# EAGLE schematic scoreboard_proto (EAGLE 9.0.1)
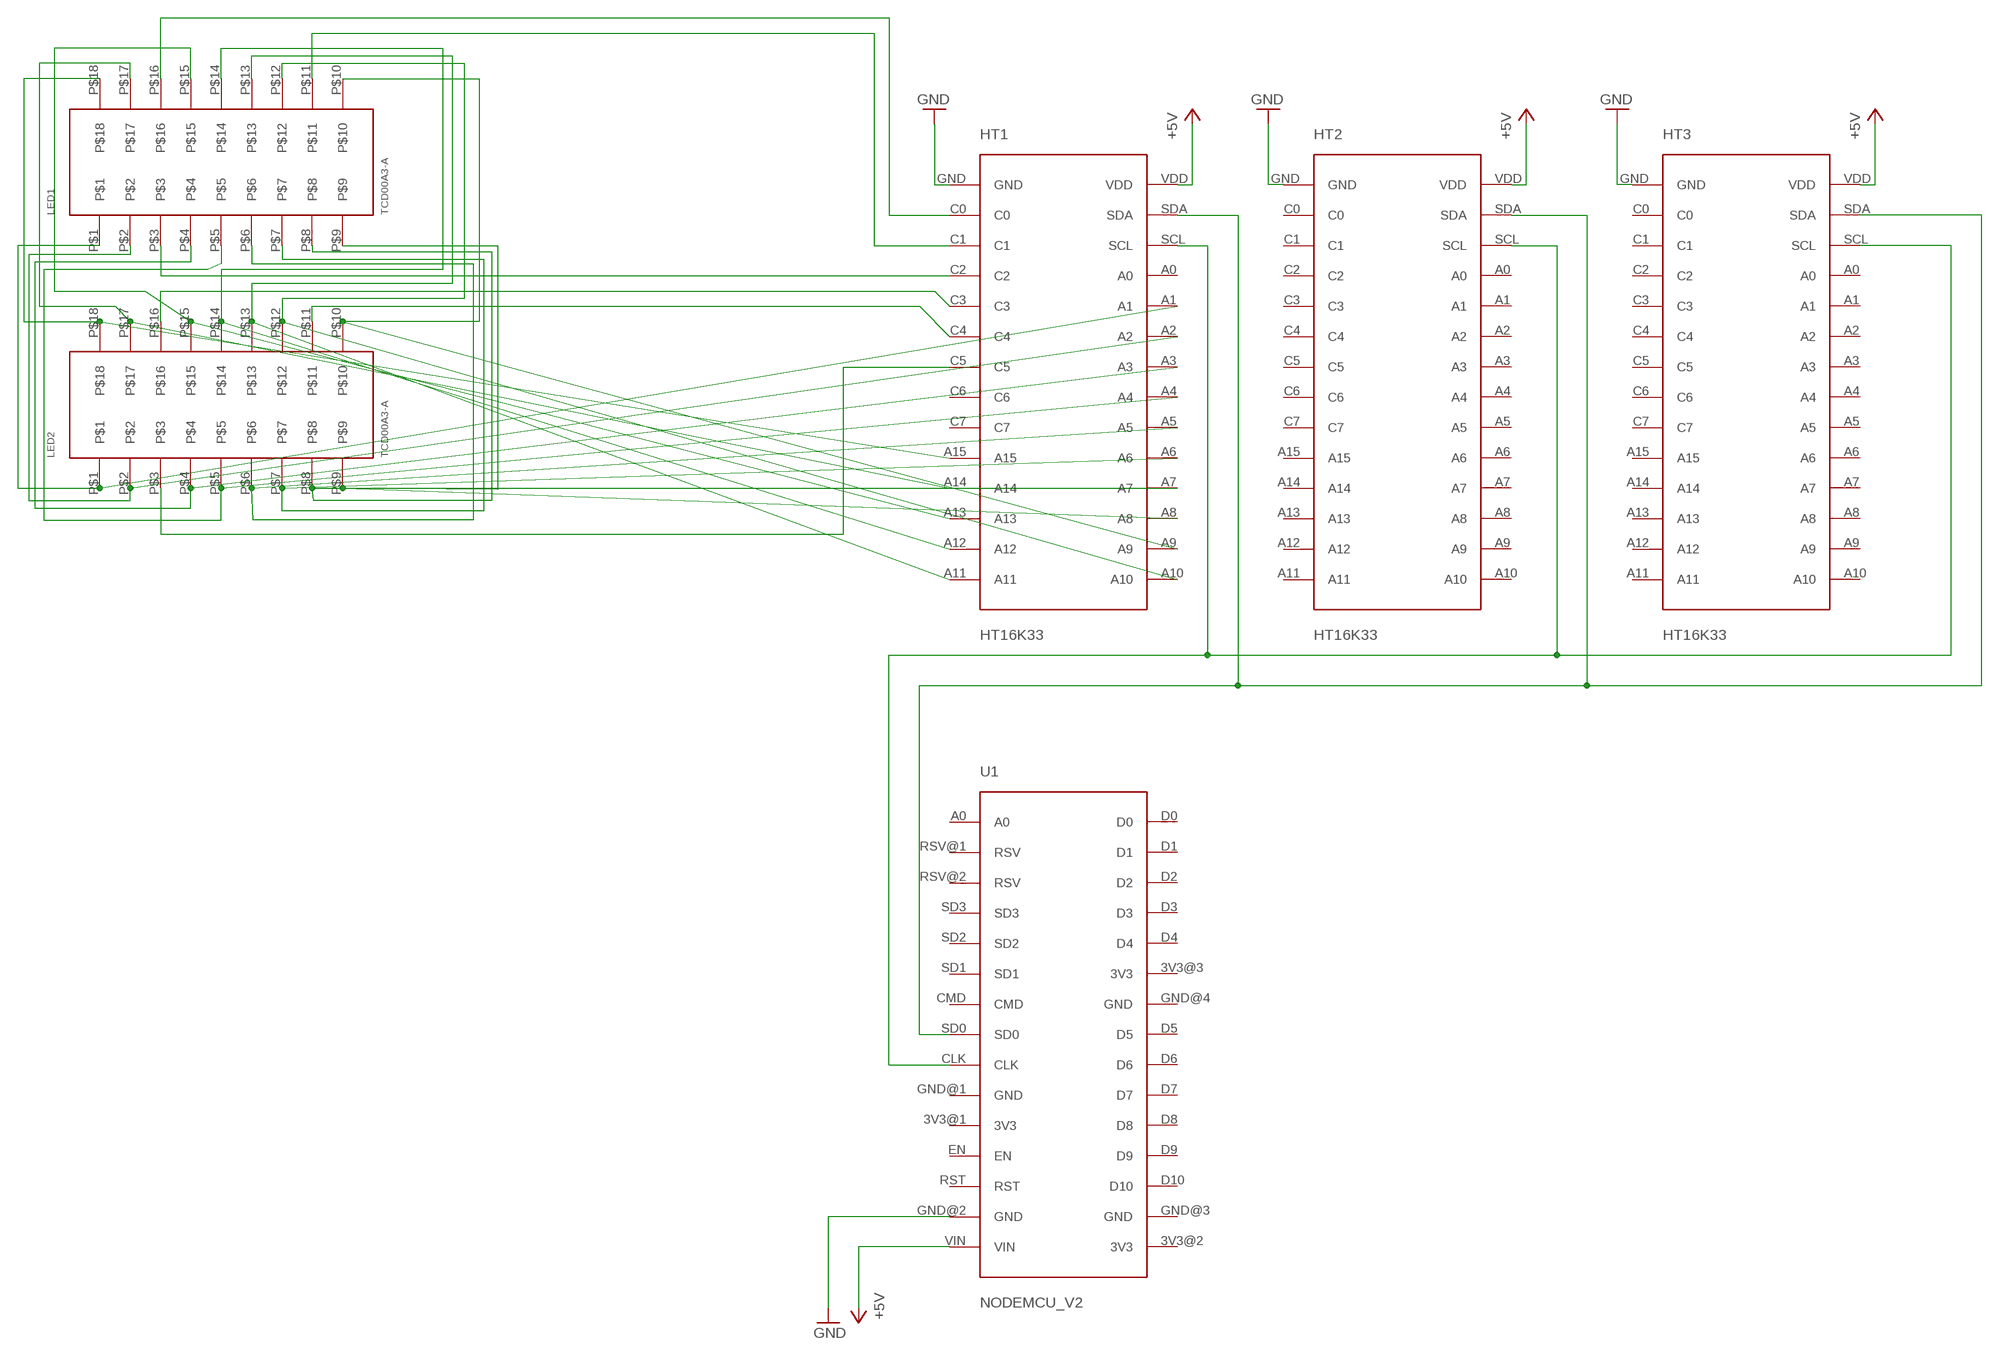
[diagram p0: schematic, sheet 1]

## Parts
HT1  HT16K33  [HT16K33]
HT2  HT16K33  [HT16K33]
HT3  HT16K33  [HT16K33]
LED1  TCD00A3-A  [TCD00A3-A]
LED2  TCD00A3-A  [TCD00A3-A]
U1  NODEMCU_V2  [ESP8266]

## Nets
+5V: HT1.VDD HT2.VDD HT3.VDD U1.VIN
GND: HT1.GND HT2.GND HT3.GND U1.GND@2(GND)
N$1: HT1.SDA HT2.SDA HT3.SDA U1.SD0
N$2: HT1.SCL HT2.SCL HT3.SCL U1.CLK
N$3: HT1.C0 LED1.P$16
N$4: HT1.C1 LED1.P$11
N$5: HT1.C2 LED1.P$3
N$6: HT1.C3 LED2.P$16
N$7: HT1.C4 LED2.P$11
N$8: HT1.C5 LED2.P$3
N$9: HT1.A15 LED1.P$18 LED2.P$18
N$10: HT1.A14 LED1.P$17 LED2.P$17
N$11: HT1.A13 LED1.P$15 LED2.P$15
N$12: HT1.A9 LED1.P$10 LED2.P$10
N$13: HT1.A10 LED1.P$12 LED2.P$12
N$14: HT1.A11 LED1.P$13 LED2.P$13
N$15: HT1.A12 LED1.P$14 LED2.P$14
N$16: HT1.A1 LED1.P$1 LED2.P$1
N$17: HT1.A2 LED1.P$2 LED2.P$2
N$18: HT1.A3 LED1.P$4 LED2.P$4
N$19: HT1.A8 LED1.P$9 LED2.P$9
N$20: HT1.A7 LED1.P$8 LED2.P$8
N$21: HT1.A6 LED1.P$7 LED2.P$7
N$22: HT1.A5 LED1.P$6 LED2.P$6
N$23: HT1.A4 LED1.P$5 LED2.P$5
Unconnected: HT1.A0 HT1.C6 HT1.C7 HT2.A0 HT2.A1 HT2.A2 HT2.A3 HT2.A4 HT2.A5 HT2.A6 HT2.A7 HT2.A8 HT2.A9 HT2.A10 HT2.A11 HT2.A12 HT2.A13 HT2.A14 HT2.A15 HT2.C0 HT2.C1 HT2.C2 HT2.C3 HT2.C4 HT2.C5 HT2.C6 HT2.C7 HT3.A0 HT3.A1 HT3.A2 HT3.A3 HT3.A4 HT3.A5 HT3.A6 HT3.A7 HT3.A8 HT3.A9 HT3.A10 HT3.A11 HT3.A12 HT3.A13 HT3.A14 HT3.A15 HT3.C0 HT3.C1 HT3.C2 HT3.C3 HT3.C4 HT3.C5 HT3.C6 HT3.C7 U1.3V3@1(3V3) U1.3V3@2(3V3) U1.3V3@3(3V3) U1.A0 U1.CMD U1.D0 U1.D1 U1.D2 U1.D3 U1.D4 U1.D5 U1.D6 U1.D7 U1.D8 U1.D9 U1.D10 U1.EN U1.GND@1(GND) U1.GND@3(GND) U1.GND@4(GND) U1.RST U1.RSV@1(RSV) U1.RSV@2(RSV) U1.SD1 U1.SD2 U1.SD3

## Library data of the parts
HT1-HT3 = ScoreBoard:HT16K33
LED1 LED2 = ScoreBoard:TCD00A3-A: 3 Digits 14 Segment LED Display
U1 = ScoreBoard:NODEMCU_V2